# Altium project 28Pins_Project_V1I1.PrjPcb (part 1 of 5)
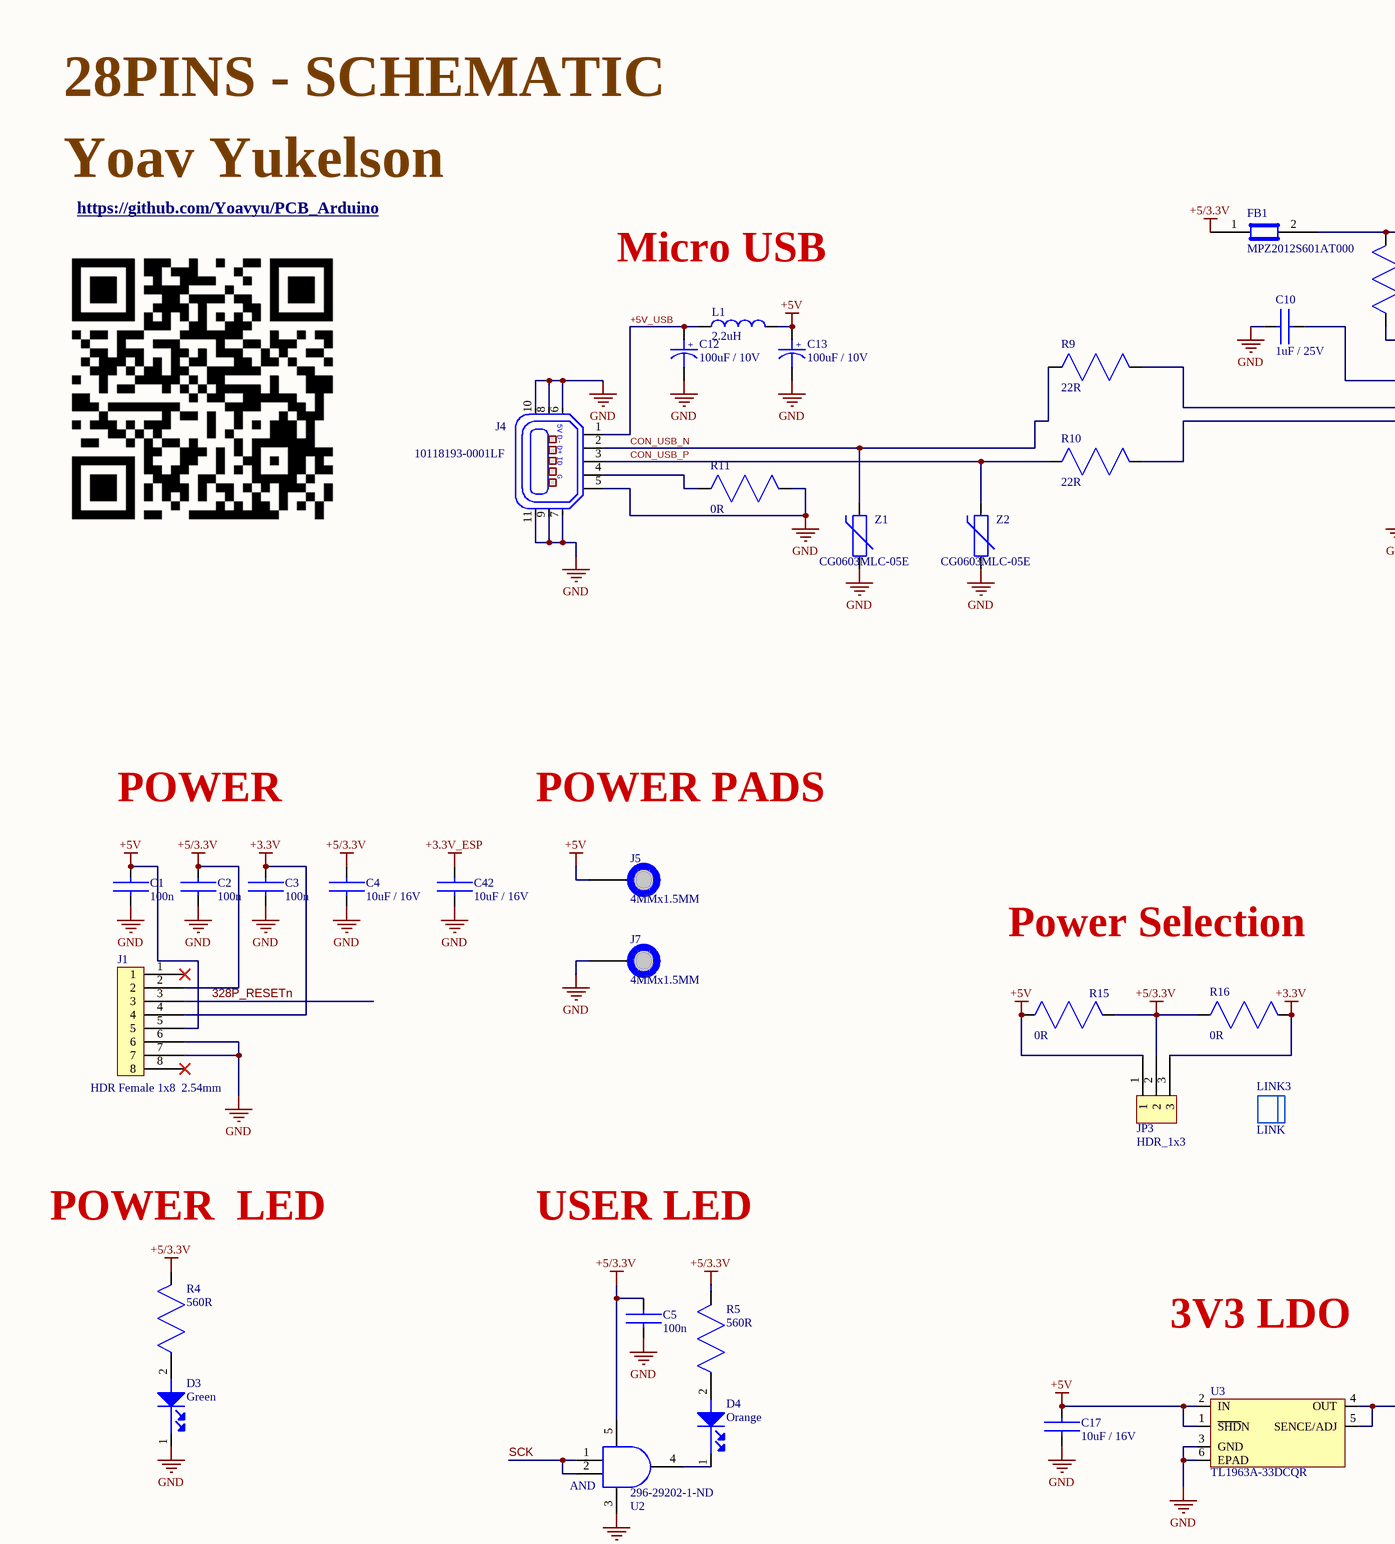
[diagram p0: 28Pins_Schematic.SchDoc, top left]
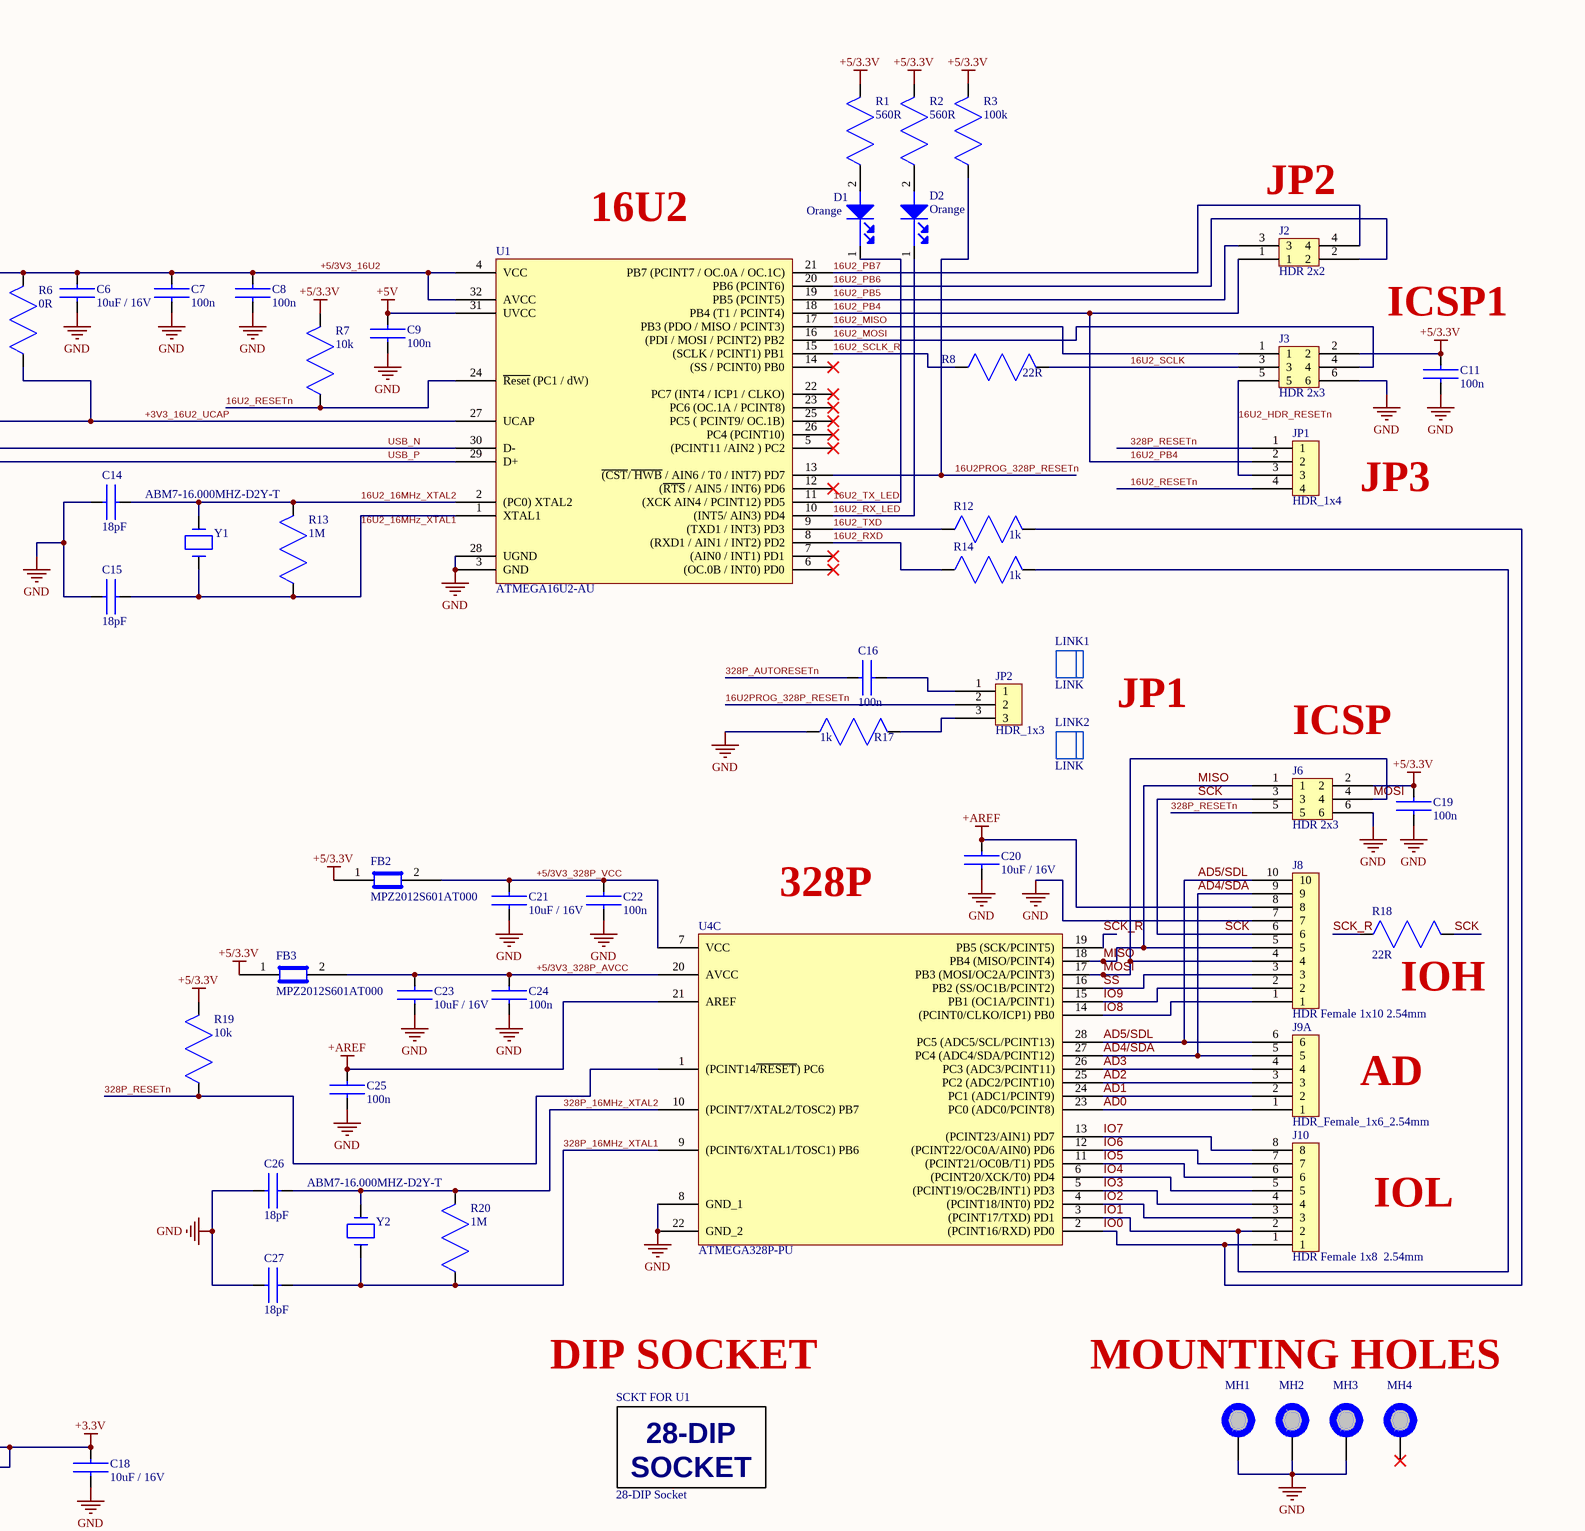
[diagram p1: 28Pins_Schematic.SchDoc, top right]
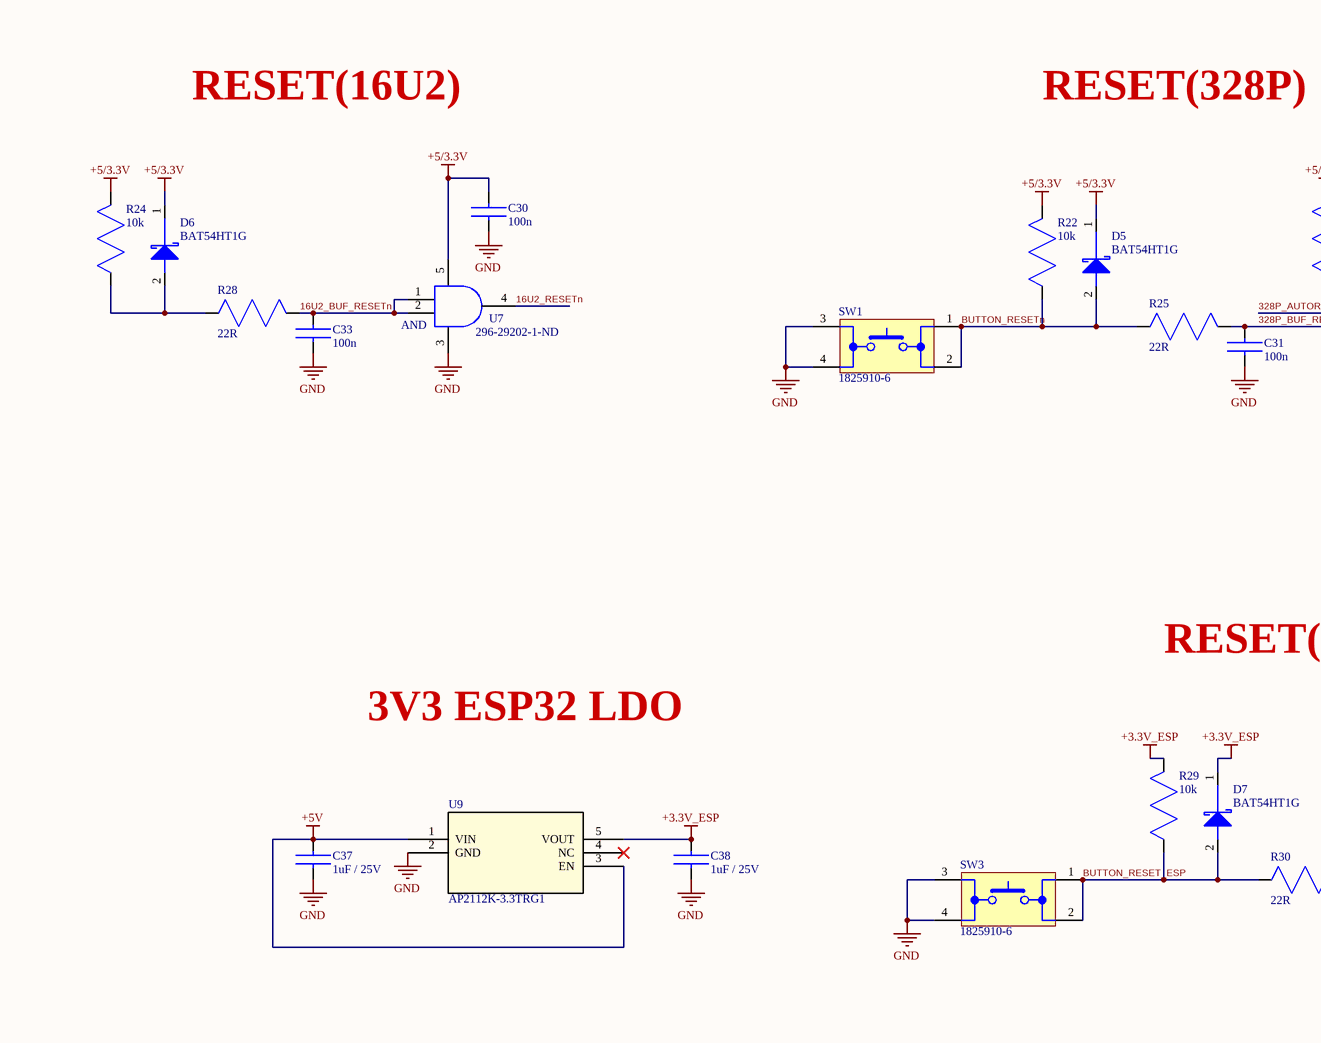
[diagram p2: 28Pins_Schematic.SchDoc, bottom left]
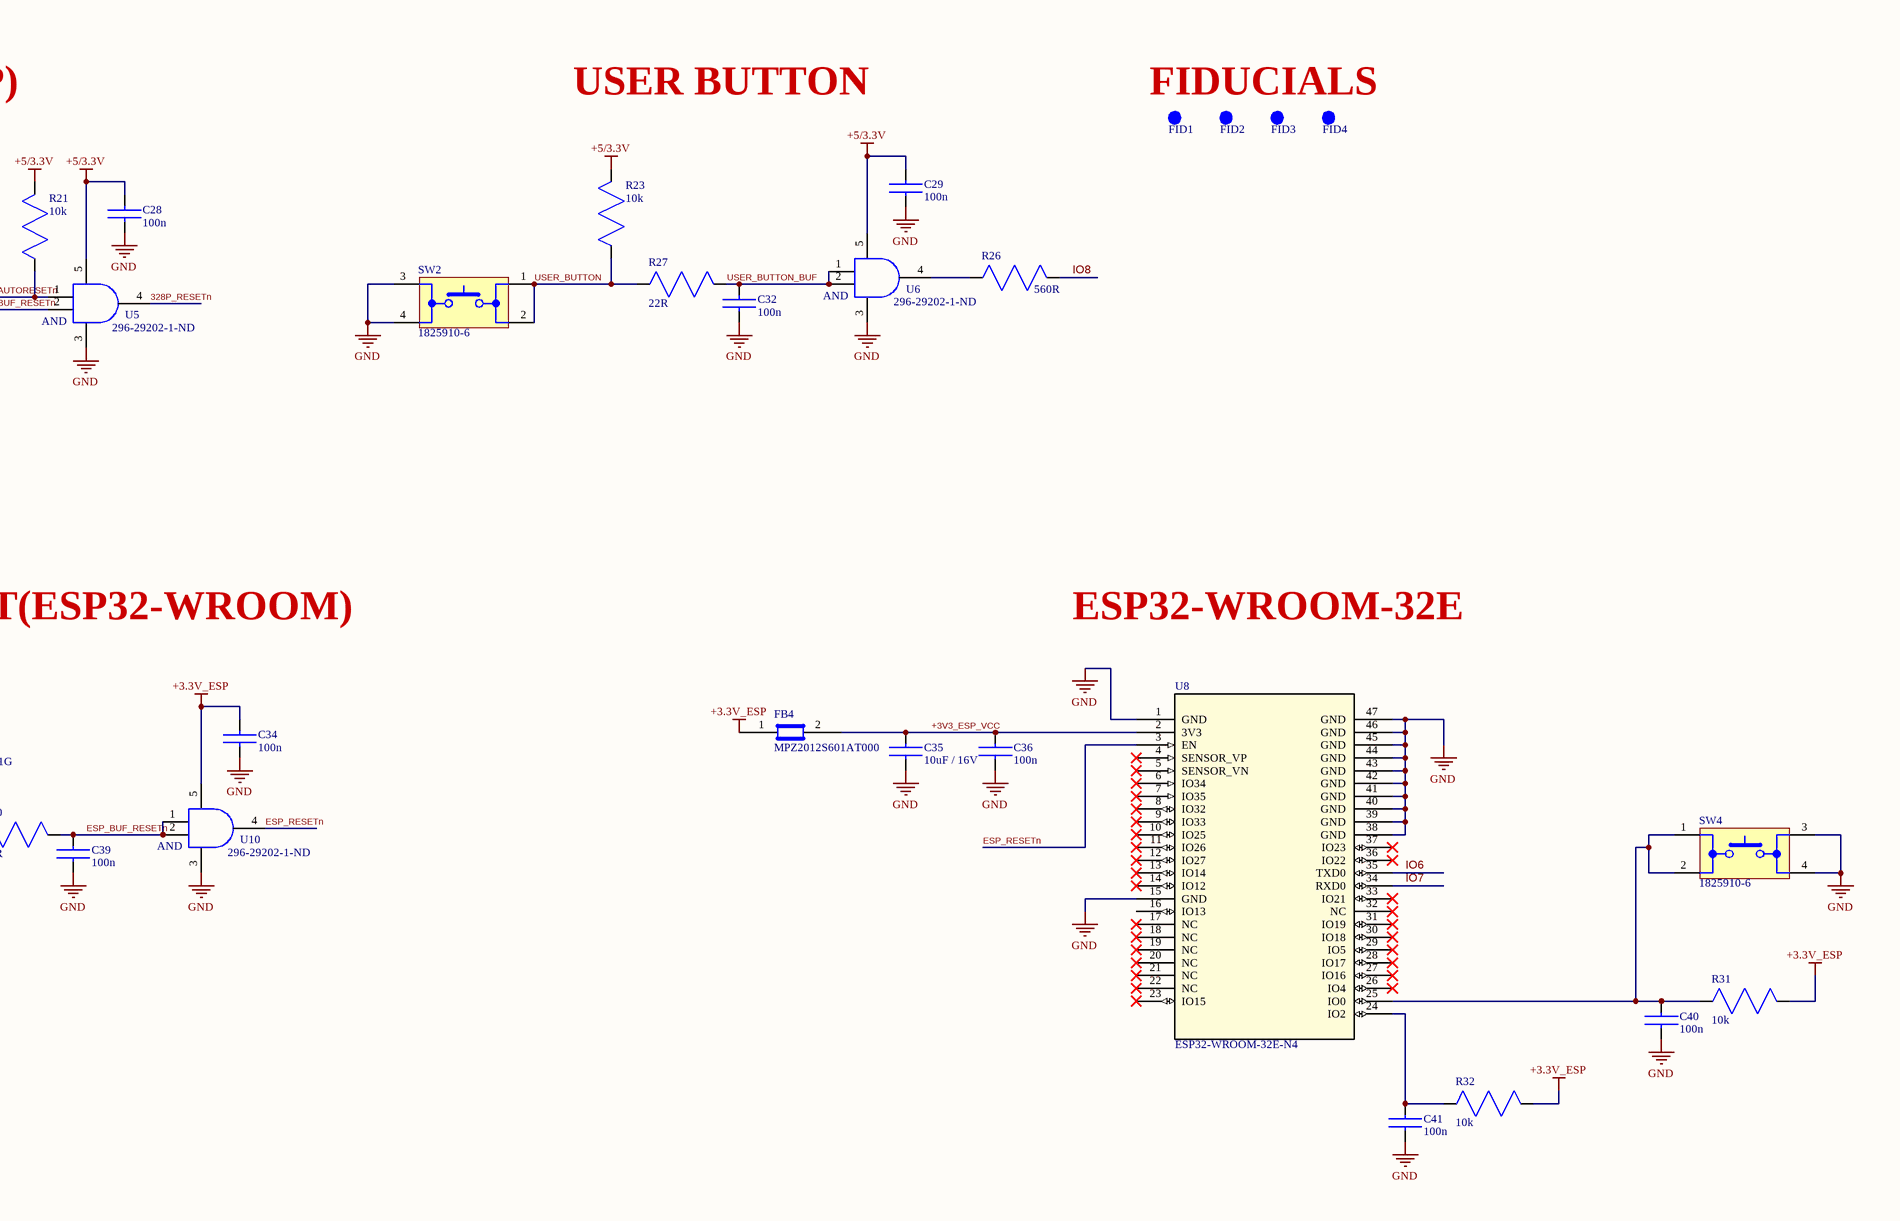
[diagram p3: 28Pins_Schematic.SchDoc, bottom right]
Notfitted: NF
1 sheet, 129 parts. Net scope: global (net labels, ports and power ports of the same name join across sheets).
Board file: 28Pins_Project_V1I1_PCB.PcbDoc

## Sheet 28Pins_Schematic.SchDoc
size A1; SheetNumber: 1; SheetTotal: 1

### Parts
C1  100n  [C0805]
C2  100n  [C0805]
C3  100n  [C0805]
C4  10uF / 16V  [C0805]
C5  100n  [C0805]
C6  10uF / 16V  [C0805]
C7  100n  [C0805]
C8  100n  [C0805]
C9  100n  [C0805]
C10  1uF / 25V  [C0805]
C11  100n  [C0805]
C12  100uF / 10V  [C_ALU_C_SIZE]
C13  100uF / 10V  [C_ALU_C_SIZE]
C14  18pF  [C0805]
C15  18pF  [C0805]
C16  100n  [C0805]
C17  10uF / 16V  [C0805]
C18  10uF / 16V  [C0805]
C19  100n  [C0805]
C20  10uF / 16V  [C0805]
C21  10uF / 16V  [C0805]
C22  100n  [C0805]
C23  10uF / 16V  [C0805]
C24  100n  [C0805]
C25  100n  [C0805]
C26  18pF  [C0805]
C27  18pF  [C0805]
C28  100n  [C0805]
C29  100n  [C0805]
C30  100n  [C0805]
C31  100n  [C0805]
C32  100n  [C0805]
C33  100n  [C0805]
C34  100n  [C0805]
C35  10uF / 16V  [C0805]
C36  100n  [C0805]
C37  1uF / 25V  [C0805]
C38  1uF / 25V  [C0805]
C39  100n  [C0805]
C40  100n  [C0805]
C41  100n  [C0805]
C42  10uF / 16V  [C0805]
D1  Orange  [LED_0603]
D2  Orange  [LED_0603]
D3  Green  [LED_0603]
D4  Orange  [LED_0603]
D5  BAT54HT1G  [SOD323]
D6  BAT54HT1G  [SOD323]
D7  BAT54HT1G  [SOD323]
FB1  MPZ2012S601AT000  [C0805]
FB2  MPZ2012S601AT000  [C0805]
FB3  MPZ2012S601AT000  [C0805]
FB4  MPZ2012S601AT000  [C0805]
FID1  FID_1MMC  [FID_40X120D]  (value not drawn)  (no BOM)
FID2  FID_1MMC  [FID_40X120D]  (value not drawn)  (no BOM)
FID3  FID_1MMC  [FID_40X120D]  (value not drawn)  (no BOM)
FID4  FID_1MMC  [FID_40X120D]  (value not drawn)  (no BOM)
J1  HDR Female 1x8  2.54mm  [Hdr_Female_1x8_2.54mm]
J2  HDR 2x2  [HDR_2x2_2.54mm]
J3  HDR 2x3  [HDR_2x3_2.54mm]
J4  10118193-0001LF  [10118193]
J5  4MMx1.5MM  [PAD_WITH_HOLE_4MMx1.5mm]  (no BOM)
J6  HDR 2x3  [HDR_2x3_2.54mm]
J7  4MMx1.5MM  [PAD_WITH_HOLE_4MMx1.5mm]  (no BOM)
J8  HDR Female 1x10 2.54mm  [Hdr_Female_1x10_2.54mm]
J9  HDR_Female_1x6_2.54mm  [Hdr_Female_1x6_2.54mm]  (part A of 3)
J10  HDR Female 1x8  2.54mm  [Hdr_Female_1x8_2.54mm]
JP1  HDR_1x4  [Hdr_1x4_2.54mm]
JP2  HDR_1x3  [Hdr_Female_1x3_2.54mm]
JP3  HDR_1x3  [Hdr_Female_1x3_2.54mm]
L1  2.2uH  [C1210_IND]
LINK1  LINK  (mechanical)
LINK2  LINK  (mechanical)
LINK3  LINK  (mechanical)
MH1  MH_7.4MMC_3.2MMD  [MH_7.4MMC_3.2MMD]  (value not drawn)  (no BOM)
MH2  MH_7.4MMC_3.2MMD  [MH_7.4MMC_3.2MMD]  (value not drawn)  (no BOM)
MH3  MH_7.4MMC_3.2MMD  [MH_7.4MMC_3.2MMD]  (value not drawn)  (no BOM)
MH4  MH_7.4MMNC_3.2MMD  [MH_7.4MMNC_3.2MMD_NON_COPPER_NPTH]  (value not drawn)  (no BOM)
R1  560R  [R0805]
R2  560R  [R0805]
R3  100k  [R0805]
R4  560R  [R0805]
R5  560R  [R0805]
R6  0R  [R0805]
R7  10k  [R0805]
R8  22R  [R0805]
R9  22R  [R0805]
R10  22R  [R0805]
R11  0R  [R0805]
R12  1k  [R0805]
R13  1M  [R0805]
R14  1k  [R0805]
R15  0R  [R0805]
R16  0R  [R0805]
R17  1k  [R0805]
R18  22R  [R0805]
R19  10k  [R0805]
R20  1M  [R0805]
R21  10k  [R0805]
R22  10k  [R0805]
R23  10k  [R0805]
R24  10k  [R0805]
R25  22R  [R0805]
R26  560R  [R0805]
R27  22R  [R0805]
R28  22R  [R0805]
R29  10k  [R0805]
R30  22R  [R0805]
R31  10k  [R0805]
R32  10k  [R0805]
SCKT_FOR_U1  28-DIP Socket  [28_DIP_7.62mm_SOCKET]
SW1  1825910-6  [1825910-6]
SW2  1825910-6  [1825910-6]
SW3  1825910-6  [1825910-6]
SW4  1825910-6  [1825910-6]
U1  ATMEGA16U2-AU  [TQFP32]
U2  296-29202-1-ND  [DBV_SOT_23_5]
U3  TL1963A-33DCQR  [DCQ]
U4  ATMEGA328P-PU  [28_DIP_7.62mm - duplicate]  (part C of 3)
U5  296-29202-1-ND  [DBV_SOT_23_5]
U6  296-29202-1-ND  [DBV_SOT_23_5]
U7  296-29202-1-ND  [DBV_SOT_23_5]
U8  ESP32-WROOM-32E-N4  [ESP32-WROOM-32E-N4]
U9  AP2112K-3.3TRG1  [AP2112K-3.3TRG1]
U10  296-29202-1-ND  [DBV_SOT_23_5]
Y1  ABM7-16.000MHZ-D2Y-T  [ABM7_v1_1_BIG]
Y2  ABM7-16.000MHZ-D2Y-T  [ABM7_v1_1_BIG]
Z1  CG0603MLC-05E  [R0603]
Z2  CG0603MLC-05E  [R0603]

### Nets
+3.3V: C3.2 C18.2 J1.4 JP3.3 R16.2 U3.4(OUT) U3.5(SENCE/ADJ)
+3.3V_ESP: C34.2 C38.2 C42.2 D7.1(Cathode) FB4.1 R29.2 R31.2 R32.2 U9.5(VOUT) U10.5
+5/3.3V: C2.2 C4.2 C5.2 C11.2 C19.2 C28.2 C29.2 C30.2 D5.1(Cathode) D6.1(Cathode) FB1.1 FB2.1 FB3.1 J1.2 J3.2 J6.2 JP3.2 R1.2 R2.2 R3.2 R4.2 R5.2 R7.2 R15.2 R16.1 R19.2 R21.2 R22.2 R23.2 R24.2 U2.5 U5.5 U6.5 U7.5
+5V: C1.2 C9.2 C13.1 C17.2 C37.2 J1.5 J5.1 JP3.1 L1.2 R15.1 U1.31(UVCC) U3.1(~{SHD}N) U3.2(IN) U9.1(VIN) U9.3(EN)
+AREF: C20.2 C25.2 J8.8 U4.21(AREF)
GND: C1.1 C2.1 C3.1 C4.1 C5.1 C6.1 C7.1 C8.1 C9.1 C10.1 C11.1 C12.2 C13.2 C14.1 C15.1 C17.1 C18.1 C19.1 C20.1 C21.1 C22.1 C23.1 C24.1 C25.1 C26.1 C27.1 C28.1 C29.1 C30.1 C31.1 C32.1 C33.1 C34.1 C35.1 C36.1 C37.1 C38.1 C39.1 C40.1 C41.1 C42.1 D3.1(Cathode) J1.6 J1.7 J3.6 J4.5 J4.6 J4.7 J4.8 J4.9 J4.10 J4.11 J6.6 J7.1 J8.7 MH1.1 MH2.1 MH3.1 R11.2 R17.1 SW1.3 SW1.4 SW2.3 SW2.4 SW3.3 SW3.4 SW4.3 SW4.4 U1.3(GND) U1.28(UGND) U2.3 U3.3(GND) U3.6(EPAD) U4.8(GND_1) U4.22(GND_2) U5.3 U6.3 U7.3 U8.1(GND) U8.15(GND) U8.38(GND) U8.39(GND) U8.40(GND) U8.41(GND) U8.42(GND) U8.43(GND) U8.44(GND) U8.45(GND) U8.46(GND) U8.47(GND) U9.2(GND) U10.3 Z1.1 Z2.1
16U2_16MHz_XTAL1: C15.2 R13.1 U1.1(XTAL1) Y1.1
16U2_16MHz_XTAL2: C14.2 R13.2 U1.2((PC0)_XTAL2) Y1.2
16U2_BUF_RESETn: C33.2 R28.2 U7.1 U7.2
16U2_HDR_RESETn: J3.5 JP1.3
16U2_MISO: J3.1 U1.17(PB3_(PDO_/_MISO_/_PCINT3))
16U2_MOSI: J3.4 U1.16((PDI_/_MOSI_/_PCINT2)_PB2)
16U2_PB4: J2.1 JP1.2 U1.18(PB4_(T1_/_PCINT4))
16U2_PB5: J2.3 U1.19(PB5_(PCINT5))
16U2_PB6: J2.2 U1.20(PB6_(PCINT6))
16U2_PB7: J2.4 U1.21(PB7_(PCINT7_/_OC.0A_/_OC.1C))
16U2_RESETn: JP1.4 R7.1 U1.24(~{Reset}_(PC1_/_dW)) U7.4
16U2_RX_LED: D2.1(Cathode) U1.10((INT5/_AIN3)_PD4)
16U2_RXD: R14.1 U1.8((RXD1_/_AIN1_/_INT2)_PD2)
16U2_SCLK: J3.3 R8.2
16U2_SCLK_R: R8.1 U1.15((SCLK_/_PCINT1)_PB1)
16U2_TX_LED: D1.1(Cathode) U1.11((XCK_AIN4_/_PCINT12)_PD5)
16U2_TXD: R12.1 U1.9((TXD1_/_INT3)_PD3)
16U2PROG_328P_RESETn: JP2.2 R3.1 U1.13(~{(CST}/~{_HWB}_/_AIN6_/_T0_/_INT7)_PD7)
328P_16MHz_XTAL1: C27.2 R20.1 U4.9((PCINT6/XTAL1/TOSC1)_PB6) Y2.1
328P_16MHz_XTAL2: C26.2 R20.2 U4.10((PCINT7/XTAL2/TOSC2)_PB7) Y2.2
328P_AUTORESETn: C16.1 R21.1 U5.1
328P_BUF_RESETn: C31.2 R25.2 U5.2
328P_RESETn: J1.3 J6.5 JP1.1 R19.1 U4.1((PCINT14~{/RESET})_PC6) U5.4
+3V3_16U2_UCAP: C10.2 R6.1 U1.27(UCAP)
+3V3_ESP_VCC: C35.2 C36.2 FB4.2 U8.2(3V3)
+5/3V3_16U2: C6.2 C7.2 C8.2 FB1.2 R6.2 U1.4(VCC) U1.32(AVCC)
+5/3V3_328P_AVCC: C23.2 C24.2 FB3.2 U4.20(AVCC)
+5/3V3_328P_VCC: C21.2 C22.2 FB2.2 U4.7(VCC)
+5V_USB: C12.1 J4.1 L1.1
AD0: J9.1 U4.23(PC0_(ADC0/PCINT8))
AD1: J9.2 U4.24(PC1_(ADC1/PCINT9))
AD2: J9.3 U4.25(PC2_(ADC2/PCINT10))
AD3: J9.4 U4.26(PC3_(ADC3/PCINT11))
AD4/SDA: J8.9 J9.5 U4.27(PC4_(ADC4/SDA/PCINT12))
AD5/SDL: J8.10 J9.6 U4.28(PC5_(ADC5/SCL/PCINT13))
BUTTON_RESET_ESP: D7.2(Anode) R29.1 R30.1 SW3.1 SW3.2
BUTTON_RESETn: D5.2(Anode) R22.1 R25.1 SW1.1 SW1.2
CON_USB_N: J4.2 R9.1 Z1.2
CON_USB_P: J4.3 R10.1 Z2.2
ESP_BUF_RESETn: C39.2 R30.2 U10.1 U10.2
ESP_RESETn: U8.3(EN) U10.4
IO0: J10.1 R12.2 U4.2((PCINT16/RXD)_PD0)
IO1: J10.2 R14.2 U4.3((PCINT17/TXD)_PD1)
IO2: J10.3 U4.4((PCINT18/INT0)_PD2)
IO3: J10.4 U4.5((PCINT19/OC2B/INT1)_PD3)
IO4: J10.5 U4.6((PCINT20/XCK/T0)_PD4)
IO5: J10.6 U4.11((PCINT21/OC0B/T1)_PD5)
IO6: J10.7 U4.12((PCINT22/OC0A/AIN0)_PD6) U8.35(TXD0)
IO7: J10.8 U4.13((PCINT23/AIN1)_PD7) U8.34(RXD0)
IO8: J8.1 R26.2 U4.14((PCINT0/CLKO/ICP1)_PB0)
IO9: J8.2 U4.15(PB1_(OC1A/PCINT1))
MISO: J6.1 J8.5 U4.18(PB4_(MISO/PCINT4))
MOSI: J6.4 J8.4 U4.17(PB3_(MOSI/OC2A/PCINT3))
SCK: J6.3 J8.6 R18.2 U2.1 U2.2
SCK_R: R18.1 U4.19(PB5_(SCK/PCINT5))
SS: J8.3 U4.16(PB2_(SS/OC1B/PCINT2))
USB_N: R9.2 U1.30(D-)
USB_P: R10.2 U1.29(D+)
USER_BUTTON: R23.1 R27.1 SW2.1 SW2.2
USER_BUTTON_BUF: C32.2 R27.2 U6.1 U6.2
NetC16_2: C16.2 JP2.1
NetC40_2: C40.2 R31.1 SW4.1 SW4.2 U8.25(IO0)
NetC41_2: C41.2 R32.1 U8.24(IO2)
NetD1_2: D1.2(Anode) R1.1
NetD2_2: D2.2(Anode) R2.1
NetD3_2: D3.2(Anode) R4.1
NetD4_1: D4.1(Cathode) U2.4
NetD4_2: D4.2(Anode) R5.1
NetD6_2: D6.2(Anode) R24.1 R28.1
NetJ4_4: J4.4 R11.1
NetJP2_3: JP2.3 R17.2
NetR26_1: R26.1 U6.4

Not connected (* = marked no-connect by the designer): J1 1* 8*; MH4 1*; U1 5((PCINT11_/AIN2_)_PC2)* 6((OC.0B_/_INT0)_PD0)* 7((AIN0_/_INT1)_PD1)* 12((~{RTS}_/_AIN5_/_INT6)_PD6)* 14((SS_/_PCINT0)_PB0)* 22(PC7_(INT4_/_ICP1_/_CLKO))* 23(PC6_(OC.1A_/_PCINT8))* 25(PC5_(_PCINT9/_OC.1B))* 26(PC4_(PCINT10))*; U8 4(SENSOR_VP)* 5(SENSOR_VN)* 6(IO34)* 7(IO35)* 8(IO32)* 9(IO33)* 10(IO25)* 11(IO26)* 12(IO27)* 13(IO14)* 14(IO12)* 16(IO13) 17(NC)* 18(NC)* 19(NC)* 20(NC)* 21(NC)* 22(NC)* 23(IO15)* 26(IO4)* 27(IO16)* 28(IO17)* 29(IO5)* 30(IO18)* 31(IO19)* 32(NC)* 33(IO21)* 36(IO22)* 37(IO23)*; U9 4(NC)*

### Notes on the sheet
- 28PINS - SCHEMATIC
- Yoav Yukelson
- (near U1) 16U2
- (near J2) JP2
- https://github.com/Yoavyu/PCB_Arduino
- Micro USB
- (near C11) ICSP1
- JP3
- JP1
- ICSP
- POWER
- POWER PADS
- (near U4) 328P
- Power Selection
- (near R18) IOH
- AD
- IOL
- POWER  LED
- USER LED
- 3V3 LDO
- DIP SOCKET
- MOUNTING HOLES
- RESET(16U2)
- RESET(328P)
- USER BUTTON
- FIDUCIALS
- RESET(ESP32-WROOM)
- ESP32-WROOM-32E
- 3V3 ESP32 LDO
- (in symbol 4828-3004-CP) 28-DIP; SOCKET
- (in symbol 10118193-0001LF) 5V; D-; D+; ID; G
- (in symbol EEE-1AA101WR) +